# EAGLE design TempModuleDS18B20 (EAGLE 5.11)
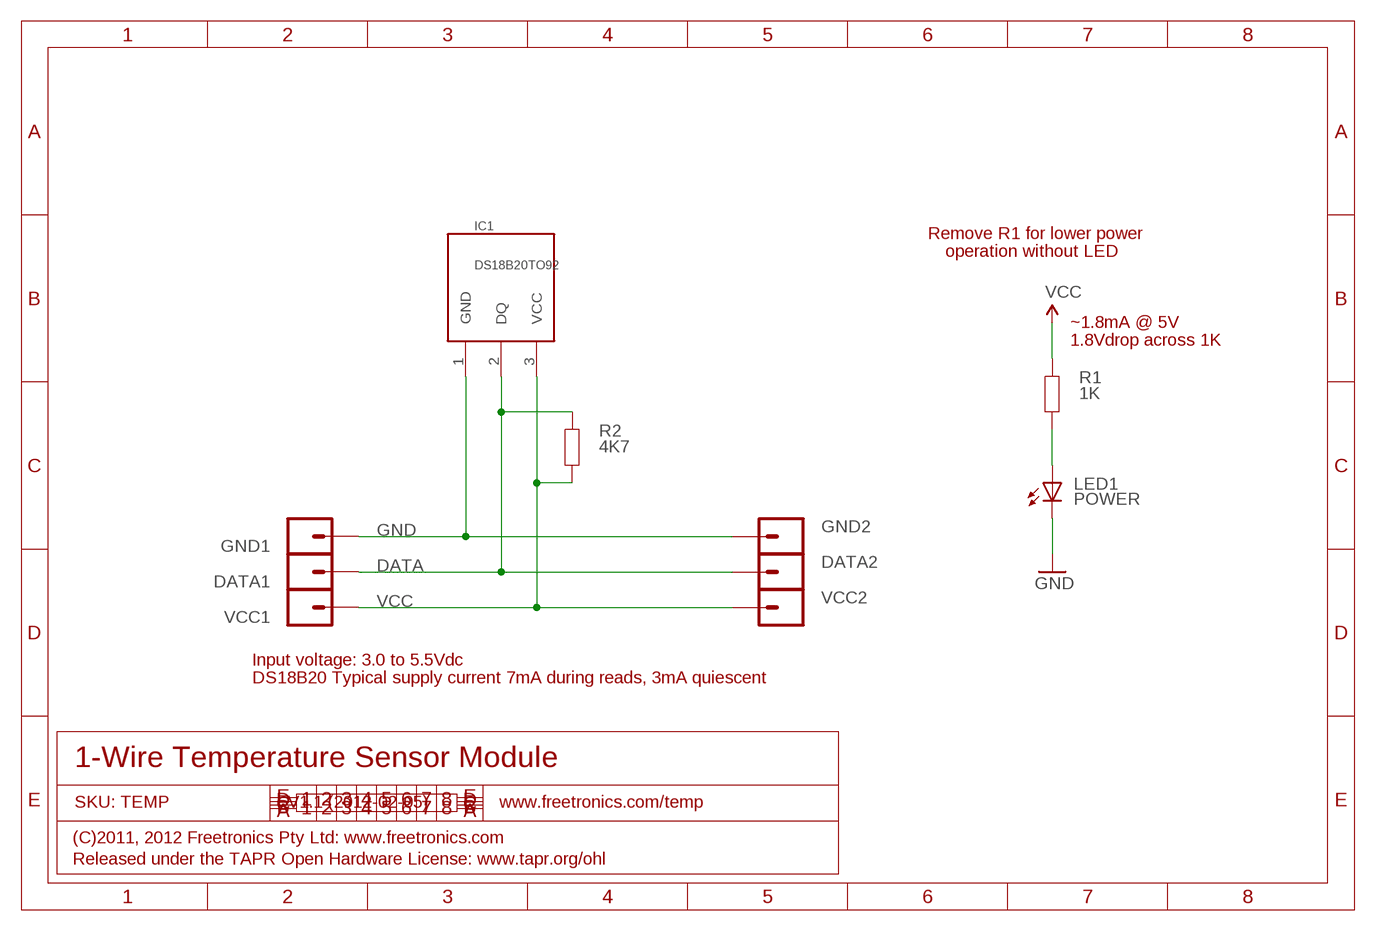
[diagram p0: schematic, sheet 1]

## Parts
DATA1  M01PTH  [1X01]
DATA2  M01PTH  [1X01]
GND1  M01PTH  [1X01]
GND2  M01PTH  [1X01]
IC1  DS18B20TO92  [TO92FLAT]
LED1  POWER  LED0603  [LED-0603]
R1  1K  RESISTOR0603  [0603]
R2  4K7  RESISTOR0603  [0603]
VCC1  M01PTH  [1X01]
VCC2  M01PTH  [1X01]

## Nets
DATA: DATA1.1 DATA2.1 IC1.2(DQ) R2.2
GND: GND1.1 GND2.1 IC1.1(GND) LED1.C
N$1: LED1.A R1.1
VCC: IC1.3(VCC) R1.2 R2.1 VCC1.1 VCC2.1

## Notes on the sheet
- Remove R1 for lower power
- operation without LED
- ~1.8mA @ 5V
- 1.8Vdrop across 1K
- Input voltage: 3.0 to 5.5Vdc
- DS18B20 Typical supply current 7mA during reads, 3mA quiescent
- 1-Wire Temperature Sensor Module
- SKU: TEMP | V1.1 (2012-02-05) | www.freetronics.com/temp
- (C)2011, 2012 Freetronics Pty Ltd: www.freetronics.com
- Released under the TAPR Open Hardware License: www.tapr.org/ohl

## Library data of the parts
DATA1 DATA2 GND1 GND2 VCC1 VCC2 = freetronics-master-v1:M01: Header 1 Standard 1-pin 0.1" header. Use with straight break away headers (SKU : PRT-00116), right angle break away headers (PRT-00553), swiss pins (PRT-00743), machine pins (PRT-00117), and female headers (PRT-00115).
IC1 = freetronics-jon:DS18B20
LED1 = freetronics-marc:LED: LEDs Standard schematic elements and footprints for 5mm, 3mm, 1206, and 0603 sized LEDs. 5mm - Spark Fun Electronics SKU : COM-00529 (and others)
R1 R2 = freetronics-master-v1:RESISTOR: Resistor Basic schematic elements and footprints for 0603, 1206, and PTH 1/10th watt (small) resistors.

## Board
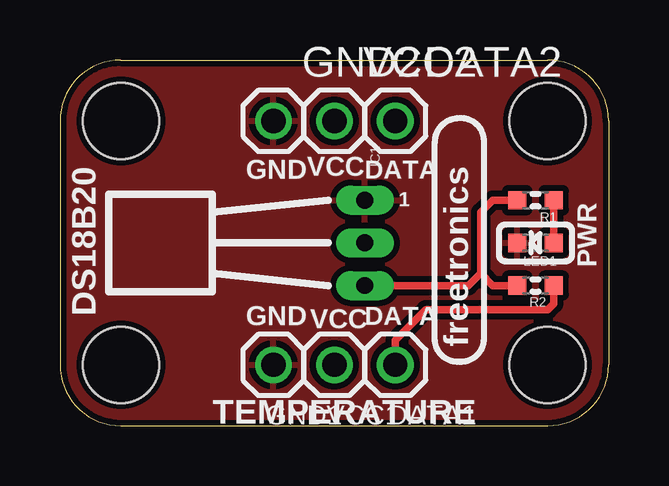
[diagram p1: board, top side]
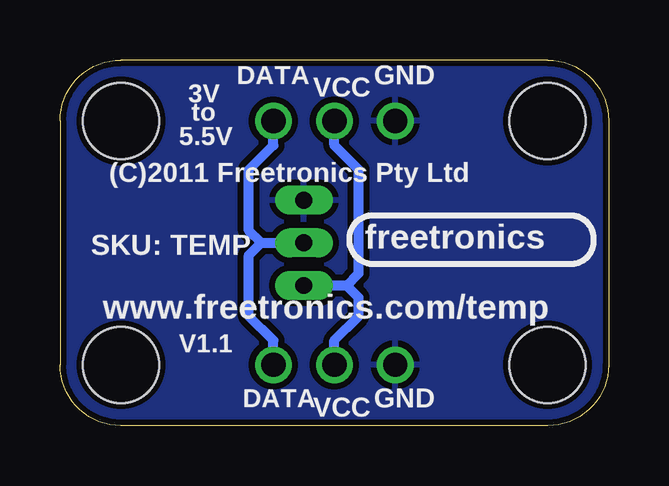
[diagram p2: board, bottom side, seen from below]

Size 22.86 x 15.24 mm. Coordinates in mm from the lower left corner, seen from the top.
Outline: 0,2.54 arc90 2.54,0 20.32,0 arc90 22.86,2.54 22.86,12.7 arc90 20.32,15.24 2.54,15.24 arc90 0,12.7 0,2.54
Copper layers (1*16): Top 0.035mm / dielectric 1.5mm / Bottom 0.035mm
Design rules "default *": minimum track width 8mil, minimum drill 15mil, track to track 10mil, track to pad 10mil, pad to pad 10mil, via to via 10mil, smd to smd 8mil, copper to edge 10mil, drill to drill 8mil, minimum pad ring 10mil, minimum via ring 8mil, stop-mask expansion 4mil, vias tented up to drill 25mil, thermal gap 10mil
Holes 3.17 mm at 2.54,2.54 20.32,2.54 2.54,12.7 20.32,12.7

### Footprints (pad centres in the part's own frame; a part is rotated, then mirrored left to right if it is on the bottom)
1X01 = drill 1.016 round: 1 0,0
TO92FLAT = drill 0.7 long: 1 1.778,0; 2 0,0; 3 -1.778,0
LED-0603 = smd 0.762 x 0.762: A -0.762,0; C 0.762,0
0603 = smd 0.762 x 0.762: 1 -0.762,0; 2 0.762,0

### Placement (x,y rotation side)
DATA1  13.97,2.54 0 top
DATA2  13.97,12.7 0 top
GND1  8.89,2.54 0 top
GND2  8.89,12.7 0 top
IC1  12.7,7.62 90 top
LED1  19.81,7.62 180 top
R1  19.81,9.4 180 top
R2  19.81,5.84 0 top
VCC1  11.43,2.54 0 top
VCC2  11.43,12.7 0 top

### Tracks (layer width: path | path; a pad name or v marks a point on that pad's centre or on a via)
DATA
  Top 0.305: R2.2 20.57,5.08 20.32,4.83 15.24,4.83 13.97,3.56 DATA1.1
  Bottom 0.406: DATA1.1 13.97,3.56 14.99,4.57 14.99,7.11 14.48,7.62 | 14.48,7.62 IC1.2 | DATA2.1 13.97,11.68 14.99,10.67 14.99,8.13 14.48,7.62
GND
  pour Bottom: 2.54,15.24 arc90 0,12.7 0,2.54 arc90 2.54,0 20.32,0 arc90 22.86,2.54 22.86,12.7 arc90 20.32,15.24
  pour Top: 0,12.7 0,2.54 arc90 2.54,0 20.32,0 arc90 22.86,2.54 22.86,12.7 arc90 20.32,15.24 2.54,15.24 arc90
N$1
  Top 0.305: LED1.A R1.1
VCC
  Top 0.305: R2.1 18.03,5.84 17.53,6.35 | R1.2 18.03,9.4 17.53,8.89 17.53,6.35 | 17.53,6.35 17.02,5.84 IC1.3
  Bottom 0.406: VCC1.1 11.43,3.56 10.41,4.57 10.41,5.33 10.92,5.84 | 10.92,5.84 IC1.3 | 10.92,5.84 10.41,6.35 10.41,10.67 11.43,11.68 VCC2.1

### Text on the board
tPlace: GND | VCC | DATA | 1 | PWR | DS18B20 | GND | VCC | DATA | freetronics | TEMPERATURE
bPlace: GND | VCC | DATA | to | 3V | 5.5V | (C)2011 Freetronics Pty Ltd | freetronics | SKU: TEMP | www.freetronics.com/temp | V1.1 | GND | DATA | VCC